# Altium project Science.PrjPCB
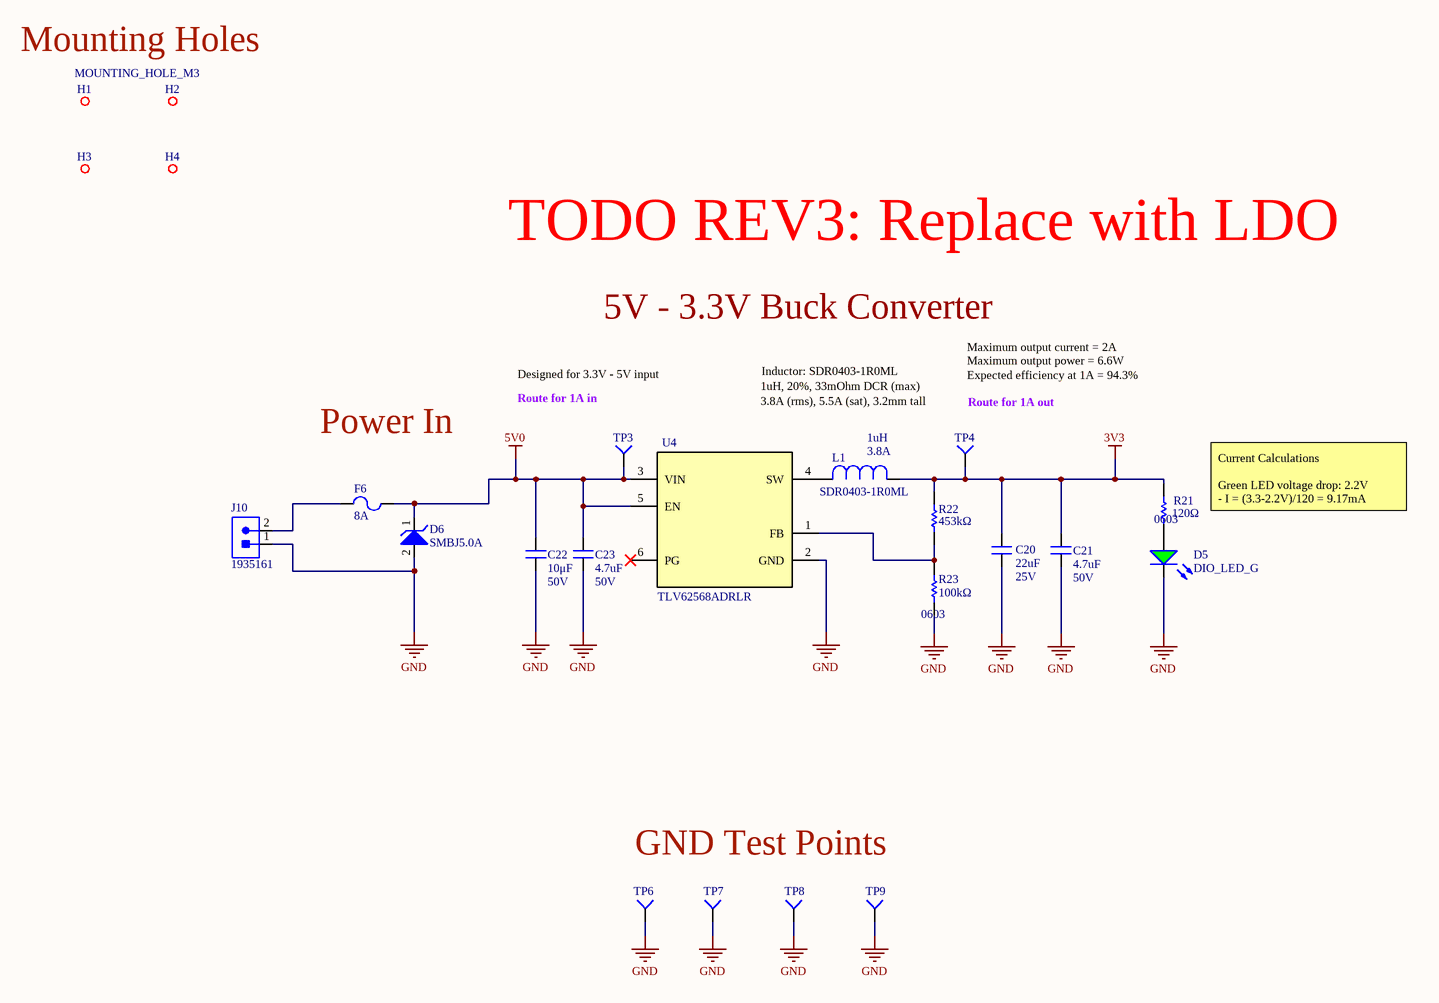
[diagram p0: SH1 - POWER.SchDoc]
Address1: 200 University Avenue; Address2: Waterloo; Address3: Ontario; Address4: Canada N2L 3G6; BoardName: Your Board Name; DrawnBy: Your Name
5 sheets, 120 parts. Net scope: flat (ports and power ports of the same name join across sheets).
Board file: Science.PcbDoc
Sheets:
  SH1 - POWER.SchDoc
  SH2 - CONNECTORS.SchDoc
  SH3 - LEVEL SHIFTER.SchDoc
  SH4 - MICROCONTROLLER.SchDoc
  SH5 - CAN.SchDoc

## Sheet SH1 - POWER.SchDoc: Power
size B; CheckedBy: Lance Bantoto; Engineer: Wolfgang Windholtz; Organization: UW Robotics; Address1: 200 University Avenue; Address2: Waterloo; Address3: Ontario; Address4: Canada N2L 3G6; DocumentNumber: 2; Revision: 2; SheetNumber: 1; SheetTotal: 5

### Parts
C20  Voltage: 25V  Capacitance: 22uF  [CAPC3225X270N]  (hidden comment: CAP_22uF_25V_1210)
C21  Capacitance: 4.7uF  Voltage: 50V  [CAP1206]  (hidden comment: CAP_4.7uF_50V_1206)
C22  value 10μF  Voltage Rating: 50V  [CAP1206]  (hidden comment: CAP_10uF_50V_1206)
C23  Capacitance: 4.7uF  Voltage: 50V  [CAP1206]  (hidden comment: CAP_4.7uF_50V_1206)
D5  DIO_LED_G  [LED_0805_GREEN]
D6  TVS_DIODE_UNIDIR_5V  [SMBJ5.0A]  (value not drawn)
F6  Current Rating: 8A  [FUSE_1206]  (hidden comment: FUSE_8A_1206)
H1  MOUNTING_HOLE_M3  [MOUNTING_HOLE_3mm_SCIENCE_REV2]  (no BOM)
H2  MOUNTING_HOLE_M3  [MOUNTING_HOLE_3mm_SCIENCE_REV2]  (value not drawn)  (no BOM)
H3  MOUNTING_HOLE_M3  [MOUNTING_HOLE_3mm_SCIENCE_REV2]  (value not drawn)  (no BOM)
H4  MOUNTING_HOLE_M3  [MOUNTING_HOLE_3mm_SCIENCE_REV2]  (value not drawn)  (no BOM)
J10  CON_2M_TERM  [1935161]  (value not drawn)
L1  value 1uH  Manufacturer Part Number 1: SDR0403-1R0ML  Current Rating: 3.8A  [IND_BOURNS_SDR04]  (hidden comment: IND_1uH_3.8A)
R21  value 120Ω  Package/Footprint: 0603  [RESC0603]  (hidden comment: RES_120Ω_0603)
R22  value 453kΩ  [RESC0603]  (hidden comment: RES_453kΩ_0603_1%)
R23  value 100kΩ  Package/Footprint: 0603  [RESC0603(1608)_N]  (hidden comment: RES_100kΩ_0603_1%)
TP3  TESTPOINT_SMD_LOOP  [S1751-46R]  (value not drawn)
TP4  TESTPOINT_SMD_LOOP  [S1751-46R]  (value not drawn)
TP6  TESTPOINT_SMD_LOOP  [S1751-46R]  (value not drawn)
TP7  TESTPOINT_1MM_SQUARE  [TESTPOINT_SQUARE_1MM]  (value not drawn)  (no BOM)
TP8  TESTPOINT_1MM_SQUARE  [TESTPOINT_SQUARE_1MM]  (value not drawn)  (no BOM)
TP9  TESTPOINT_1MM_SQUARE  [TESTPOINT_SQUARE_1MM]  (value not drawn)  (no BOM)
U4  TLV62568ADRLR  [SOT50P160X60-6N]

### Nets
3V3: C20.2 C21.2 L1.2 R21.2 R22.2 TP4.1(=value)
5V0: C22.2 C23.2 D6.1 F6.2 TP3.1(=value) U4.3(VIN) U4.5(EN)
GND: C20.1 C21.1 C22.1 C23.1 D5.2(K) D6.2 J10.1 R23.1 TP6.1(=value) TP7.1(=value) TP8.1(=value) TP9.1(=value) U4.2(GND)
NetD5_1: D5.1(A) R21.1
NetF6_1: F6.1 J10.2
NetL1_1: L1.1 U4.4(SW)
NetR22_1: R22.1 R23.2 U4.1(FB)

Not connected (* = marked no-connect by the designer): U4 6(PG)*

### Notes on the sheet
- Mounting Holes
- TODO REV3: Replace with LDO
- Designed for 3.3V - 5V input
- 5V - 3.3V Buck Converter
- Inductor: SDR0403-1R0ML
- Maximum output current = 2A
- Maximum output power = 6.6W
- Expected efficiency at 1A = 94.3%
- Power In
- (near TP3) Route for 1A in
- 1uH, 20%, 33mOhm DCR (max)
- 3.8A (rms), 5.5A (sat), 3.2mm tall
- (near TP4) Route for 1A out
- Current Calculations
  Green LED voltage drop: 2.2V
  - I = (3.3-2.2V)/120 = 9.17mA
- GND Test Points
- Title:
- Project:
- Date:
- Rev:
- Checker:
- Engineer:
- Sheet:
- of

### Library data of the parts
C20 = CAP_22uF_25V_1210: CAP CER 22UF 25V X7R 1210; Manufacturer 1: Murata Electronics; Manufacturer Part Number 1: GRM32ER71E226ME15K; Package/Footprint: 1210; Supplier 1: Digi-Key; Supplier Part Number 1: 490-14682-1-ND; Temperature Coefficient: X7R; Mounting Type: SMD
C21 = CAP_4.7uF_50V_1206: CAP CER 4.7UF 50V X7R 1206; Manufacturer 1: Murata; Manufacturer Part Number 1: GRM31CR71H475KA12L; Package/Footprint: 1206; Supplier 1: Digi-Key; Dielectric: X7R; Supplier Part Number 1: 490-6521-1-ND; Mounting Type: SMD
C22 = CAP_10uF_50V_1206: CAP CER 10UF 50V X5R 1206; Manufacturer Part Number 1: GRT31CR61H106KE01L; Manufacturer 1: Murata; Package/Footprint: 1206; Dimensions: 0.126" L x 0.063" W (3.20mm x 1.6mm); Package: 1206 (3216 Metric); Supplier Part Number 1: 490-12456-1-ND; Supplier 1: Digi-Key; Dielectric: X5R; Manufacturer Part Numer 1: GRT31CR61H106KE01L; Mounting Type: SMD
C23 = CAP_4.7uF_50V_1206: CAP CER 4.7UF 50V X7R 1206; Manufacturer Part Number 1: GRM31CR71H475KA12L; Manufacturer 1: Murata; Package/Footprint: 1206; Supplier Part Number 1: 490-6521-1-ND; Supplier 1: Digi-Key; Dielectric: X7R; Mounting Type: SMD
D5 = DIO_LED_G: LED GREEN DIFFUSED 0805 SMD; Manufacturer Part Number 1: LG R971-KN-1; Manufacturer 1: OSRAM; Forward Voltage Drop: 2.2V; Package/Footprint: 0805; Supplier Part Number 1: 475-1410-1-ND; Supplier 1: Digi-Key; Mounting Type: SMD
D6 = TVS_DIODE_UNIDIR_5V: TVS DIODE 5V 9.2V DO214AA; Manufacturer 1: Bourns; Max Power Dissipation: 600W; Polarity: Unidirectional; Leakage Current: 800uA; Reverse Breakdown Voltage: 6.4V; Max Surge Current: 100A; Breakdown Voltage: 7.25V; Peak Pulse Current: 65.2A; Test Current: 10mA; Number of Channels: 1; Operating Supply Voltage: 3.5V; Power Line Protection: No; Package/Footprint: SMB; Supplier 1: Digi-Key; Number of Pins: 2; Min Operating Temperature: -55°C; Max Operating Temperature: 150°C; Reverse Standoff Voltage: 5V; Min Breakdown Voltage: 6.4V; Clamping Voltage: 9.2V; Peak Pulse Power: 600W; Max Breakdown Voltage: 7.25V; Max Reverse Leakage Current: 800uA; Supplier Part Number 1: SMBJ5.0ABCT-ND; Manufacturer Part Number 1: SMBJ5.0A; Mounting Type: SMD
F6 = FUSE_8A_1206: FUSE SMD 8A 24V; Manufacturer 1: Littelfuse; Manufacturer Part Number 1: 1206SFF800F/24-2; Package/Footprint: 1206; Supplier 1: Digi-Key; Supplier Part Number 1: 1206SFF800F/24-2CT-ND; Mounting Type: SMD; LCSC Part #: C311032
H1-H4 = MOUNTING_HOLE_M3_SCIENCE_REV2: MOUNTING_HOLE_M3 Science Rev2
J10 = CON_2M_TERM: TERM BLK 2POS SIDE ENTRY 5MM; Manufacturer 1: Phoenix Contact; Max Current Rating: 16A; Current: 18A; Voltage: 300V; Package/Footprint: SMD; Supplier 1: Digi-Key; Supplier Part Number 1: 277-1667-ND; Manufacturer Part Number 1: 1935161; Mounting Type: TH
L1 = IND_1uH_3.8A: FIXED IND 1UH 3.8A 33 MOHM SMD; Manufacturer 1: Bourns Inc.; Tolerance: ±20%; Supplier Part Number 1: SDR0403-1R0MLCT-ND; Supplier 1: Digi-Key; Mounting Type: SMD; Package/Footprint: SMD
R21 = RES_120Ω_0603_5%: RES 120 OHM 5% 1/10W 0603; Manufacturer 1: Yageo; Manufacturer Part Number 1: RC0603JR-07120RL; Package: 0603 (1608 Metric); Supplier Part Number 1: 311-120GRCT-ND; Supplier 1: Digi-Key; Mounting Type: SMD
R22 = RES_453kΩ_0603_1%: RES 453K OHM 1% 1/10W 0603; Manufacturer 1: Panasonic Electronic Components; Manufacturer Part Number 1: ERJ-3EKF4533V; Package/Footprint: 0603; Package: 0603 (1608 Metric); Dimensions: 0.063" L x 0.031" W (1.60mm x 0.80mm); Supplier Part Number 1: P453KHCT-ND; Supplier 1: Digi-Key; Case Code (Metric): 1608; Tolerance: 1%; Mounting Type: SMD
R23 = RES_100kΩ_0603_1%: RES 100K OHM 1% 1/10W 0603; Manufacturer 1: Yageo; Manufacturer Part Number 1: RC0603FR-07100KL; Supplier Part Number 1: 311-100KHRCT-ND; Supplier 1: Digi-Key; Tolerance: 1%; Mounting Type: SMD
TP3 TP4 TP6 = TESTPOINT_SMD_LOOP: PC TEST POINT SMD; Manufacturer 1: Harwin; Supplier 1: Digi-Key; Manufacturer Part Number 1: S1751-46R; Supplier Part Number 1: 952-1478-1-ND; Mounting Type: SMD; Package/Footprint: SMD
TP7-TP9 = TESTPOINT_1MM_SQUARE: TESTPOINT 1MM SQUARE; Part Number (MPN): *
U4 = TLV62568ADRLR: IC REG BUCK ADJUSTABLE 2A SOT563; Manufacturer 1: Texas Instruments; Vin (Min): 2.5V; Vin (Max): 5.5V; Vout (Min/Fixed): 0.6V; Iout: 1A; Switching Frequency: 1.5MHz; Package/Footprint: SOT-563; Manufacturer Part Number 1: TLV62568ADRLR; Supplier 1: Digi-Key; Supplier Part Number 1: 296-50407-1-ND; Vout (Max): 5.5V; Iout (Max): 2A; Mounting Type: SMD

## Sheet SH2 - CONNECTORS.SchDoc: Connectors
size B; CheckedBy: Lance Bantoto; Engineer: Wolfgang Windholtz; Organization: UW Robotics; Address1: 200 University Avenue; Address2: Waterloo; Address3: Ontario; Address4: Canada N2L 3G6; Revision: 2; SheetNumber: 2; SheetTotal: 5
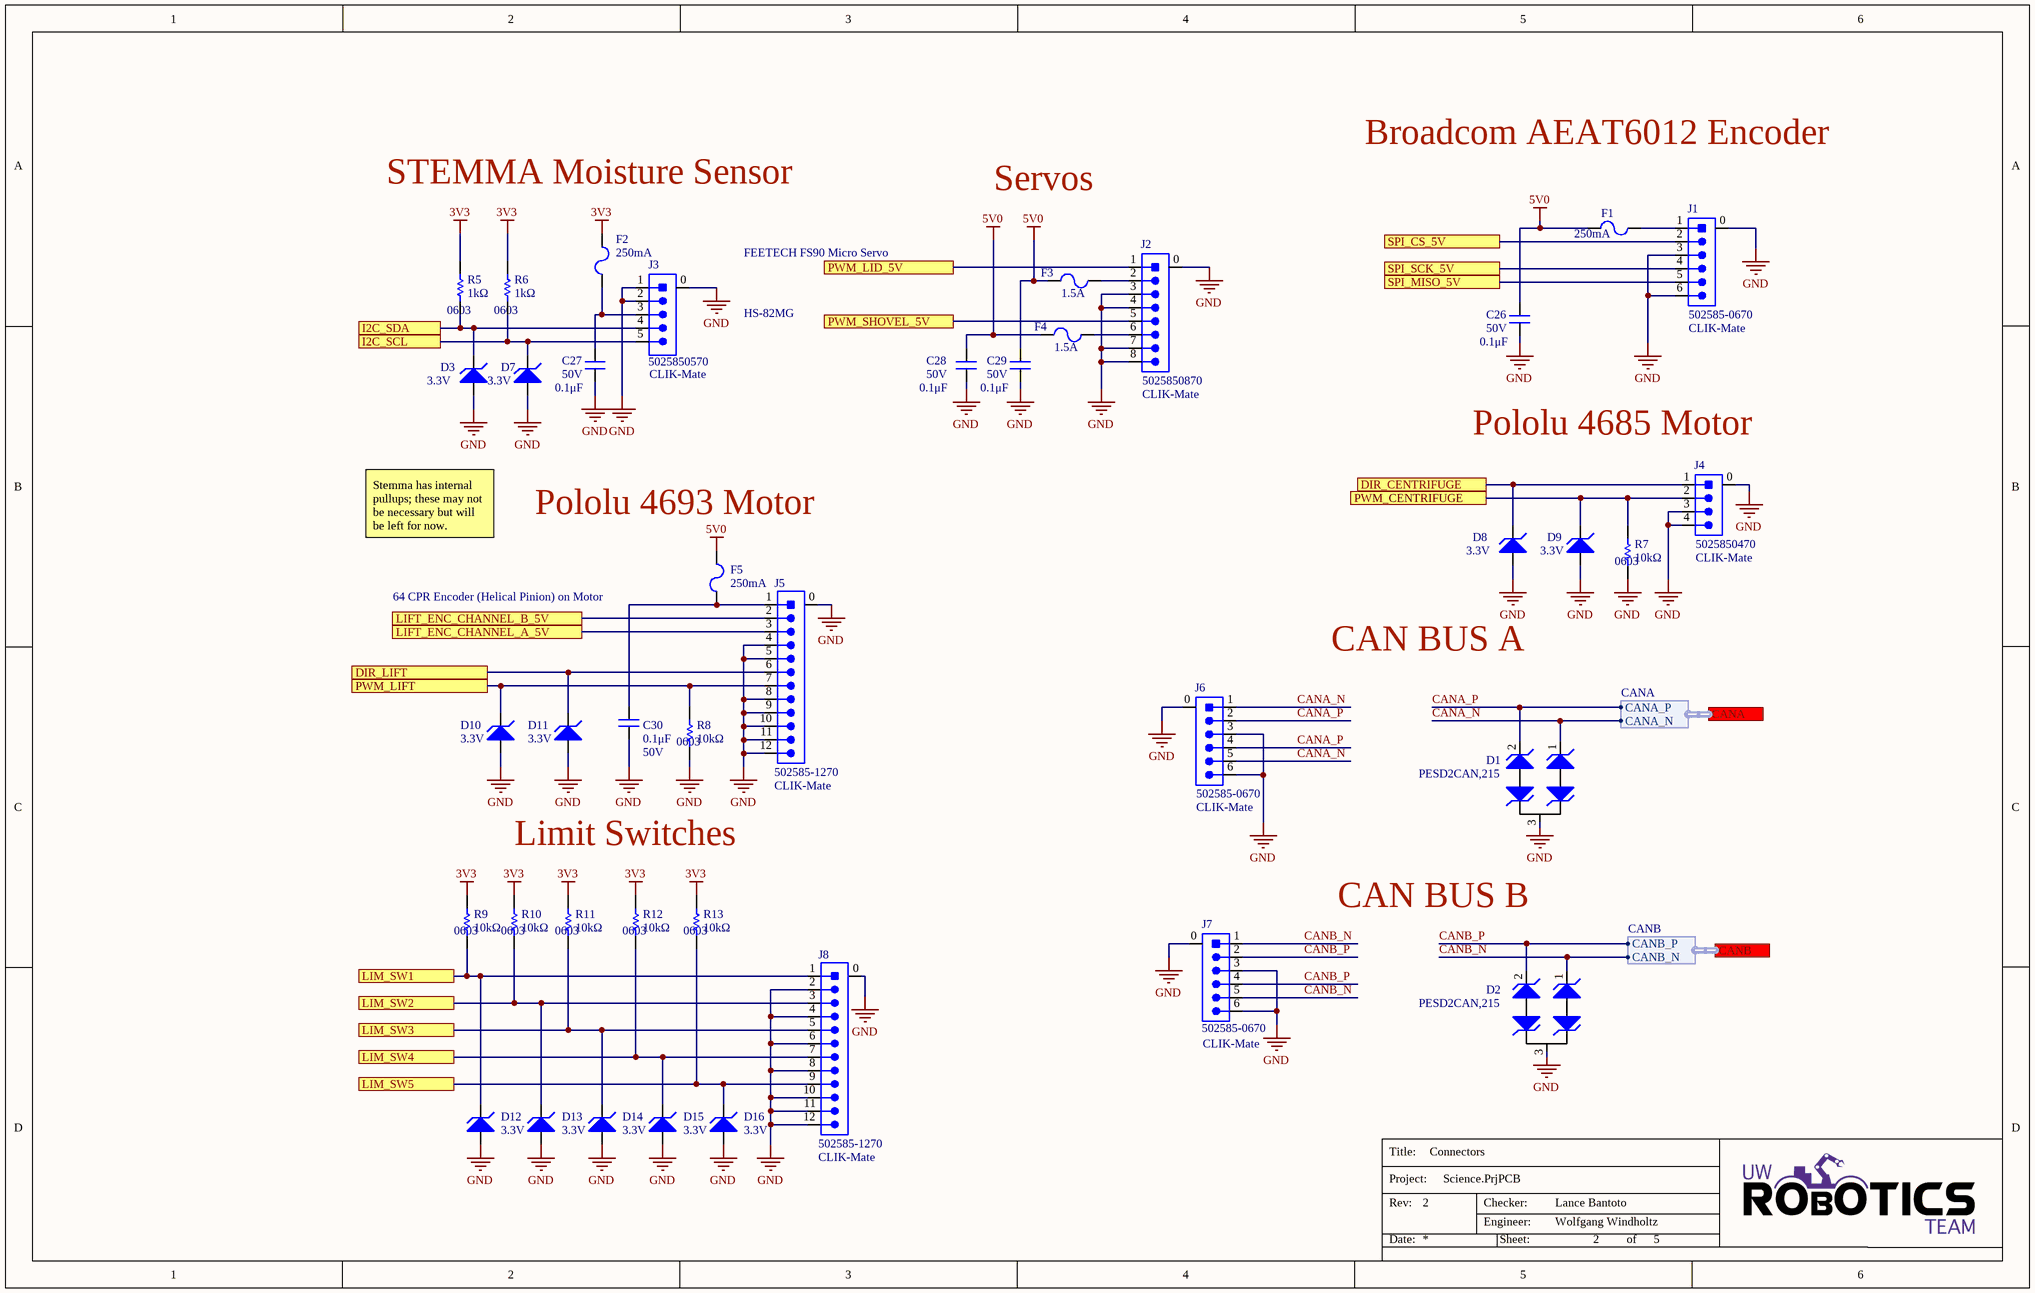
[diagram p1: SH2 - CONNECTORS.SchDoc]

### Parts
C26  value 0.1μF  Voltage Rating: 50V  [CAP0603]  (hidden comment: CAP_0.1uF_50V_0603)
C27  value 0.1μF  Voltage Rating: 50V  [CAP0603]  (hidden comment: CAP_0.1uF_50V_0603)
C28  value 0.1μF  Voltage Rating: 50V  [CAP0603]  (hidden comment: CAP_0.1uF_50V_0603)
C29  value 0.1μF  Voltage Rating: 50V  [CAP0603]  (hidden comment: CAP_0.1uF_50V_0603)
C30  value 0.1μF  Voltage Rating: 50V  [CAP0603]  (hidden comment: CAP_0.1uF_50V_0603)
D1  Manufacturer Part Number 1: PESD2CAN,215  [TVS_DIODE_CAN]  (hidden comment: TVS_DIODE_CAN)
D2  Manufacturer Part Number 1: PESD2CAN,215  [TVS_DIODE_CAN]  (hidden comment: TVS_DIODE_CAN)
D3  Reverse Standoff Voltage: 3.3V  [SOD523_UNI]  (hidden comment: ESD5Z3.3T1G)
D7  Reverse Standoff Voltage: 3.3V  [SOD523_UNI]  (hidden comment: ESD5Z3.3T1G)
D8  Reverse Standoff Voltage: 3.3V  [SOD523_UNI]  (hidden comment: ESD5Z3.3T1G)
D9  Reverse Standoff Voltage: 3.3V  [SOD523_UNI]  (hidden comment: ESD5Z3.3T1G)
D10  Reverse Standoff Voltage: 3.3V  [SOD523_UNI]  (hidden comment: ESD5Z3.3T1G)
D11  Reverse Standoff Voltage: 3.3V  [SOD523_UNI]  (hidden comment: ESD5Z3.3T1G)
D12  Reverse Standoff Voltage: 3.3V  [SOD523_UNI]  (hidden comment: ESD5Z3.3T1G)
D13  Reverse Standoff Voltage: 3.3V  [SOD523_UNI]  (hidden comment: ESD5Z3.3T1G)
D14  Reverse Standoff Voltage: 3.3V  [SOD523_UNI]  (hidden comment: ESD5Z3.3T1G)
D15  Reverse Standoff Voltage: 3.3V  [SOD523_UNI]  (hidden comment: ESD5Z3.3T1G)
D16  Reverse Standoff Voltage: 3.3V  [SOD523_UNI]  (hidden comment: ESD5Z3.3T1G)
F1  Current Rating: 250mA  [FUSE_1206]  (hidden comment: FUSE_250mA_1206)
F2  Current Rating: 250mA  [FUSE_1206]  (hidden comment: FUSE_250mA_1206)
F3  Current Rating: 1.5A  [FUSE_1206]  (hidden comment: FUSE_1.5A_1206)
F4  Current Rating: 1.5A  [FUSE_1206]  (hidden comment: FUSE_1.5A_1206)
F5  Current Rating: 250mA  [FUSE_1206]  (hidden comment: FUSE_250mA_1206)
J1  Manufactor Number: 502585-0670  Family: CLIK-Mate  [MOLEX-5025850670]  (hidden comment: CON_6M_SM_RA_1.5mm)
J2  Manufacturer Part Number: 5025850870  Family: CLIK-Mate  [MOLEX-5025850870]  (hidden comment: CON_8M_SM_RA)
J3  Manufacturer Part Number 1: 5025850570  Family: CLIK-Mate  [MOLEX-5025850570]  (hidden comment: CON_5M_SM_RA)
J4  Manufactor Number: 5025850470  Family: CLIK-Mate  [MOLEX-5025850470]  (hidden comment: CON_4M_SM_RA)
J5  Family: CLIK-Mate  Manufacturer Part Number 1: 502585-1270  [MOLEX-5025851270]  (hidden comment: CON_12M_SM_RA)
J6  Manufactor Number: 502585-0670  Family: CLIK-Mate  [MOLEX-5025850670]  (hidden comment: CON_6M_SM_RA_1.5mm)
J7  Manufactor Number: 502585-0670  Family: CLIK-Mate  [MOLEX-5025850670]  (hidden comment: CON_6M_SM_RA_1.5mm)
J8  Family: CLIK-Mate  Manufacturer Part Number 1: 502585-1270  [MOLEX-5025851270]  (hidden comment: CON_12M_SM_RA)
R5  value 1kΩ  Package/Footprint: 0603  [RESC0603]  (hidden comment: RES_1kΩ_0603_5%)
R6  value 1kΩ  Package/Footprint: 0603  [RESC0603]  (hidden comment: RES_1kΩ_0603_5%)
R7  value 10kΩ  Package/Footprint: 0603  [RESC0603]  (hidden comment: RES_10kΩ_0603_5%)
R8  value 10kΩ  Package/Footprint: 0603  [RESC0603]  (hidden comment: RES_10kΩ_0603_5%)
R9  value 10kΩ  Package/Footprint: 0603  [RESC0603]  (hidden comment: RES_10kΩ_0603_5%)
R10  value 10kΩ  Package/Footprint: 0603  [RESC0603]  (hidden comment: RES_10kΩ_0603_5%)
R11  value 10kΩ  Package/Footprint: 0603  [RESC0603]  (hidden comment: RES_10kΩ_0603_5%)
R12  value 10kΩ  Package/Footprint: 0603  [RESC0603]  (hidden comment: RES_10kΩ_0603_5%)
R13  value 10kΩ  Package/Footprint: 0603  [RESC0603]  (hidden comment: RES_10kΩ_0603_5%)

### Ports
CANA (harness CANA), CANB (harness CANB), DIR_CENTRIFUGE, DIR_LIFT, I2C_SCL, I2C_SDA, LIFT_ENC_CHANNEL_A_5V, LIFT_ENC_CHANNEL_B_5V, LIM_SW1, LIM_SW2, LIM_SW3, LIM_SW4, LIM_SW5, PWM_CENTRIFUGE, PWM_LID_5V, PWM_LIFT, PWM_SHOVEL_5V, SPI_CS_5V, SPI_MISO_5V, SPI_SCK_5V

### Harnesses
CANA: CANA_P, CANA_N
CANB: CANB_P, CANB_N

### Nets
3V3: F2.2 R5.2 R6.2 R9.2 R10.2 R11.2 R12.2 R13.2
5V0: C26.2 C28.2 C29.2 F1.2 F3.1 F4.1 F5.2
GND: C26.1 C27.1 C28.1 C29.1 C30.1 D1.3 D2.3 D3.1(Anode) D7.1(Anode) D8.1(Anode) D9.1(Anode) D10.1(Anode) D11.1(Anode) D12.1(Anode) D13.1(Anode) D14.1(Anode) D15.1(Anode) D16.1(Anode) J1.0 J1.3 J1.6 J2.0 J2.3 J2.4 J2.7 J2.8 J3.0 J3.1 J3.2 J4.0 J4.3 J4.4 J5.0 J5.4 J5.5 J5.8 J5.9 J5.10 J5.11 J5.12 J6.0 J6.3 J6.6 J7.0 J7.3 J7.6 J8.0 J8.2 J8.4 J8.6 J8.8 J8.10 J8.11 J8.12 R7.1 R8.1
CANA_N: D1.1 J6.1 J6.5 ; port CANA.CANA_N
CANA_P: D1.2 J6.2 J6.4 ; port CANA.CANA_P
CANB_N: D2.1 J7.1 J7.5 ; port CANB.CANB_N
CANB_P: D2.2 J7.2 J7.4 ; port CANB.CANB_P
DIR_CENTRIFUGE: D8.2(Cathode) J4.1 ; port DIR_CENTRIFUGE
DIR_LIFT: D11.2(Cathode) J5.6 ; port DIR_LIFT
I2C_SCL: D7.2(Cathode) J3.5 R6.1 ; port I2C_SCL
I2C_SDA: D3.2(Cathode) J3.4 R5.1 ; port I2C_SDA
LIFT_ENC_CHANNEL_A_5V: J5.3 ; port LIFT_ENC_CHANNEL_A_5V
LIFT_ENC_CHANNEL_B_5V: J5.2 ; port LIFT_ENC_CHANNEL_B_5V
LIM_SW1: D12.2(Cathode) J8.1 R9.1 ; port LIM_SW1
LIM_SW2: D13.2(Cathode) J8.3 R10.1 ; port LIM_SW2
LIM_SW3: D14.2(Cathode) J8.5 R11.1 ; port LIM_SW3
LIM_SW4: D15.2(Cathode) J8.7 R12.1 ; port LIM_SW4
LIM_SW5: D16.2(Cathode) J8.9 R13.1 ; port LIM_SW5
PWM_CENTRIFUGE: D9.2(Cathode) J4.2 R7.2 ; port PWM_CENTRIFUGE
PWM_LID_5V: J2.1 ; port PWM_LID_5V
PWM_LIFT: D10.2(Cathode) J5.7 R8.2 ; port PWM_LIFT
PWM_SHOVEL_5V: J2.5 ; port PWM_SHOVEL_5V
SPI_CS_5V: J1.2 ; port SPI_CS_5V
SPI_MISO_5V: J1.5 ; port SPI_MISO_5V
SPI_SCK_5V: J1.4 ; port SPI_SCK_5V
NetC27_2: C27.2 F2.1 J3.3
NetC30_2: C30.2 F5.1 J5.1
NetF1_1: F1.1 J1.1
NetF3_2: F3.2 J2.2
NetF4_2: F4.2 J2.6

### Notes on the sheet
- Broadcom AEAT6012 Encoder
- STEMMA Moisture Sensor
- Servos
- FEETECH FS90 Micro Servo
- HS-82MG
- (near J4) Pololu 4685 Motor
- Stemma has internal pullups; these may not be necessary but will be left for now.
- (near F5) Pololu 4693 Motor
- 64 CPR Encoder (Helical Pinion) on Motor
- CAN BUS A
- Limit Switches
- CAN BUS B
- Title:
- Project:
- Date:
- Rev:
- Checker:
- Engineer:
- Sheet:
- of

### Library data of the parts
C26-C30 = CAP_0.1uF_50V_0603: CAP CER 0.1UF 50V X7R 0603; Manufacturer Part Number 1: CC0603KRX7R9BB104; Manufacturer 1: Yageo; Package/Footprint: 0603; Temperature Coefficient: X7R; Supplier Part Number 1: 311-1344-1-ND; Supplier 1: Digi-Key; Dielectric: X7R; Mounting Type: SMD
D1 D2 = TVS_DIODE_CAN: TVS DIODE 24V 41V SOT323-3; Manufacturer 1: Nexperia USA Inc.; Supplier Part Number 1: 1727-3891-1-ND; Supplier 1: Digi-Key; Package/Footprint: SOT323-3; Mounting Type: SMD
D3 D7-D16 = ESD5Z3.3T1G: TVS DIODE 3.3V 14.1V SOD523; Manufacturer 1: ON Semiconductor; Peak Pulse Power: 158W; Number of Unidirectional Channels: 1; Min Breakdown Voltage: 5V; Power Line Protection: No; Peak Pulse Current: 11.2A; Polarity: Unidirectional; ESD Protection: Yes; Capacitance: 105pF; Max Reverse Leakage Current: 50nA; Max Power Dissipation: 200mW; Package/Footprint: SOD-523; Supplier 1: Digi-Key; Category: ESD and Circuit Protection ICs; Clamping Voltage: 14.1V; Number of Lines: 1; Breakdown Voltage: 5V; Number of Elements: 1; Max Breakdown Voltage: 5V; Reverse Breakdown Voltage: 5V; Max Surge Current: 11.2A; Direction: Unidirectional; Supplier Part Number 1: ESD5Z3.3T1GOSCT-ND; Manufacturer Part Number 1: ESD5Z3.3T1G; Mounting Type: SMD
F1 F2 F5 = FUSE_250mA_1206: FUSE BOARD MNT 250MA 125VAC/VDC; Manufacturer 1: Littelfuse; Manufacturer Part Number 1: 0466.250NR; DC Cold Resistance: 31mR; Power Dissipation: 157.5mW; Approvals: UL,CSA; Working Voltage: 250V; Package/Footprint: 1206; Supplier 1: Digi-Key; Current: 250mA; Length: 3.18mm; Height: 0.023inch; Width: 0.06inch; Depth: 1.52mm; Supplier Part Number 1: F1452CT-ND; Mounting Type: SMD
F3 F4 = FUSE_1.5A_1206: FUSE SMD 1.5A 63V; Manufacturer 1: Littelfuse; Manufacturer Part Number 1: 046601.5NR; Fuse Type: Board Mount (Cartridge Style Excluded); DC Cold Resistance: 31mR; Power Dissipation: 157.5mW; Approvals: UL,CSA; Package/Footprint: 1206; Supplier 1: Digi-Key; Housing Material: Ceramic; Min Operating Temperature: -55°C; Max Operating Temperature: 90°C; Voltage Rating (AC): 63V; Voltage Rating (DC): 63V; Current: 1.5A; Length: 3.18mm; Height: 0.023inch; Width: 0.06inch; Depth: 1.52mm; Supplier Part Number 1: F1462CT-ND; Mounting Type: SMD
J1 J6 J7 = CON_6M_SM_RA_1.5mm: CONN HEADER SMD RIGHT ANGLE 1.5 MM PITCH; Manufacturer: Molex; Supplier 1: Digi-Key; Supplier Part Number 1: WM12832CT-ND; Package/Footprint: SMD; Mounting Type: SMD
J2 = CON_8M_SM_RA: CONN HEADER SMD RIGHT ANGLE 1.5 MM PITCH; Manufacturer: Molex; Current Rating: 2A; Voltage Rating: 100V; Contact Resistance: 20mR; Number of Positions: 8; Connector Type: Receptacle,Center Strip Contact; Gender: Receptacle; Pitch: 1.5mm; Glow Wire Compliant: Non-compliant; Supplier 1: Digi-Key; Category: Headers and Wire Housings; Contact Plating: Tin; Contact Material: Copper,Copper Alloy,Tin; Color: Beige; Housing Color: Beige; Housing Material: Resin; Min Operating Temperature: -40°C; Max Operating Temperature: 85°C; Number of Rows: 1; Contact Gender: Female; Fastening Type: Latch; Orientation: Right Angle; Termination: Solder; Number of Contacts: 8; Number of Circuits: 8; Length: 16.3mm; Depth: 7.3mm; REACH SVHC: Unknown; Supplier Part Number 1: WM14471CT-ND; Mounting Type: SMD; Package/Footprint: SMD
J3 = CON_5M_SM_RA: CONN HEADER SMD RIGHT ANGLE 1.5MM PITCH; Manufacturer 1: Molex; Connector Type: Receptacle,Center Strip Contact; Number of Positions: 5; Current Rating: 2A; Supplier 1: Digi-Key; Termination: Solder; Number of Contacts: 5; Orientation: Right Angle; Number of Circuits: 5; Number of Rows: 1; Supplier Part Number 1: WM14469CT-ND; Mounting Type: SMD; Package/Footprint: SMD
J4 = CON_4M_SM_RA: CONN HEADER SMD RIGHT ANGLE 1.5 MM PITCH; Manufacturer: Molex; Supplier 1: Digi-Key; Supplier Part Number 1: WM9449CT-ND; Package/Footprint: SMD; Mounting Type: SMD
J5 J8 = CON_12M_SM_RA: CONN HEADER SMD RIGHT ANGLE 1.5MM PITCH; Manufacturer 1: Molex; Number of Positions: 12; Connector Type: Receptacle,Center Strip Contact; Current Rating: 2A; Gender: Receptacle; Voltage Rating: 100V; Supplier 1: Digi-Key; Contact Plating: Tin; Contact Material: Copper Alloy,Copper,Tin; Color: Beige; Housing Material: Thermoplastic; Termination: Solder; Contact Gender: Female; Number of Contacts: 12; Number of Rows: 1; Orientation: Right Angle; Fastening Type: Latch; Number of Circuits: 12; Pitch: 1.5mm; Supplier Part Number 1: WM14473CT-ND; Mounting Type: SMD; Package/Footprint: SMD
R5 R6 = RES_1kΩ_0603_5%: RES 1K OHM 5% 1/10W 0603; Manufacturer 1: Yageo; Manufacturer Part Number 1: RC0603JR-071KL; Supplier Part Number 1: 311-1.0KGRCT-ND; Supplier 1: Digi-Key; Tolerance: 5%; Mounting Type: SMD
R7-R13 = RES_10kΩ_0603_5%: RES 10K OHM 5% 1/10W 0603; Manufacturer 1: Yageo; Manufacturer Part Number 1: RC0603JR-0710KL; Package: 0603 (1608 Metric); Supplier Part Number 1: 311-10KGRCT-ND; Supplier 1: Digi-Key; Case Code (Metric): 1608; Tolerance: 5%; Mounting Type: SMD

## Sheet SH3 - LEVEL SHIFTER.SchDoc: Level Shifter
size B; CheckedBy: Lance Bantoto; Engineer: Wolfgang Windholtz; Organization: UW Robotics; Address1: 200 University Avenue; Address2: Waterloo; Address3: Ontario; Address4: Canada N2L 3G6; Revision: 2; SheetNumber: 3; SheetTotal: 5
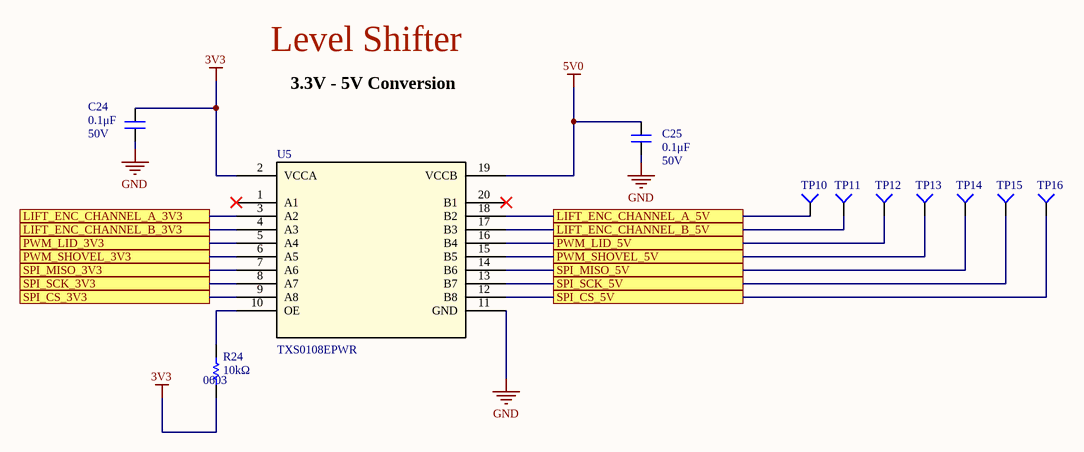
[diagram p2: SH3 - LEVEL SHIFTER.SchDoc]

### Parts
C24  value 0.1μF  Voltage Rating: 50V  [CAP0603]  (hidden comment: CAP_0.1uF_50V_0603)
C25  value 0.1μF  Voltage Rating: 50V  [CAP0603]  (hidden comment: CAP_0.1uF_50V_0603)
R24  value 10kΩ  Package/Footprint: 0603  [RESC0603]  (hidden comment: RES_10kΩ_0603_5%)
TP10  TESTPOINT_1MM_CIRCLE  [TESTPOINT_CIRCLE_1MM]  (value not drawn)  (no BOM)
TP11  TESTPOINT_1MM_CIRCLE  [TESTPOINT_CIRCLE_1MM]  (value not drawn)  (no BOM)
TP12  TESTPOINT_1MM_CIRCLE  [TESTPOINT_CIRCLE_1MM]  (value not drawn)  (no BOM)
TP13  TESTPOINT_1MM_CIRCLE  [TESTPOINT_CIRCLE_1MM]  (value not drawn)  (no BOM)
TP14  TESTPOINT_1MM_CIRCLE  [TESTPOINT_CIRCLE_1MM]  (value not drawn)  (no BOM)
TP15  TESTPOINT_1MM_CIRCLE  [TESTPOINT_CIRCLE_1MM]  (value not drawn)  (no BOM)
TP16  TESTPOINT_1MM_CIRCLE  [TESTPOINT_CIRCLE_1MM]  (value not drawn)  (no BOM)
U5  Manufacturer Part Number 1: TXS0108EPWR  [LEVEL_SHIFTER_8_CHANNEL]  (hidden comment: IC_LVL_SHIFTER_8_CH)

### Ports
LIFT_ENC_CHANNEL_A_3V3, LIFT_ENC_CHANNEL_A_5V, LIFT_ENC_CHANNEL_B_3V3, LIFT_ENC_CHANNEL_B_5V, PWM_LID_3V3, PWM_LID_5V, PWM_SHOVEL_3V3, PWM_SHOVEL_5V, SPI_CS_3V3, SPI_CS_5V, SPI_MISO_3V3, SPI_MISO_5V, SPI_SCK_3V3, SPI_SCK_5V

### Nets
3V3: C24.2 R24.1 U5.2(VCCA)
5V0: C25.2 U5.19(VCCB)
GND: C24.1 C25.1 U5.11(GND)
LIFT_ENC_CHANNEL_A_3V3: U5.3(A2) ; port LIFT_ENC_CHANNEL_A_3V3
LIFT_ENC_CHANNEL_A_5V: TP10.1(=value) U5.18(B2) ; port LIFT_ENC_CHANNEL_A_5V
LIFT_ENC_CHANNEL_B_3V3: U5.4(A3) ; port LIFT_ENC_CHANNEL_B_3V3
LIFT_ENC_CHANNEL_B_5V: TP11.1(=value) U5.17(B3) ; port LIFT_ENC_CHANNEL_B_5V
PWM_LID_3V3: U5.5(A4) ; port PWM_LID_3V3
PWM_LID_5V: TP12.1(=value) U5.16(B4) ; port PWM_LID_5V
PWM_SHOVEL_3V3: U5.6(A5) ; port PWM_SHOVEL_3V3
PWM_SHOVEL_5V: TP13.1(=value) U5.15(B5) ; port PWM_SHOVEL_5V
SPI_CS_3V3: U5.9(A8) ; port SPI_CS_3V3
SPI_CS_5V: TP16.1(=value) U5.12(B8) ; port SPI_CS_5V
SPI_MISO_3V3: U5.7(A6) ; port SPI_MISO_3V3
SPI_MISO_5V: TP14.1(=value) U5.14(B6) ; port SPI_MISO_5V
SPI_SCK_3V3: U5.8(A7) ; port SPI_SCK_3V3
SPI_SCK_5V: TP15.1(=value) U5.13(B7) ; port SPI_SCK_5V
NetR24_2: R24.2 U5.10(OE)

Not connected (* = marked no-connect by the designer): U5 1(A1)* 20(B1)*

### Notes on the sheet
- Level Shifter
- 3.3V - 5V Conversion
- Title:
- Project:
- Date:
- Rev:
- Checker:
- Engineer:
- Sheet:
- of

### Library data of the parts
C24 C25 = CAP_0.1uF_50V_0603: CAP CER 0.1UF 50V X7R 0603; Manufacturer 1: Yageo; Manufacturer Part Number 1: CC0603KRX7R9BB104; Package/Footprint: 0603; Supplier 1: Digi-Key; Dielectric: X7R; Supplier Part Number 1: 311-1344-1-ND; Temperature Coefficient: X7R; Mounting Type: SMD
R24 = RES_10kΩ_0603_5%: as R7 on sheet SH2 - CONNECTORS; Supplier 1: Digi-Key; Case Code (Metric): 1608; Tolerance: 5%; Supplier Part Number 1: 311-10KGRCT-ND; Package: 0603 (1608 Metric); Mounting Type: SMD
TP10-TP16 = TESTPOINT_1MM_CIRCLE: TESTPOINT 1MM CIRCLE; Part Number (MPN): *
U5 = IC_LVL_SHIFTER_8_CH: IC BIDIRECTIONAL LEVEL SHIFTER 8 CHANNEL 20TSSOP; Manufacturer 1: Texas Instruments; Package/Footprint: 20-TSSOP; ComponentLink1Description: New link; ComponentLink1URL: *; Supplier 1: Digi-Key; Supplier Part Number 1: 296-23011-1-ND; Mounting Type: SMD

## Sheet SH4 - MICROCONTROLLER.SchDoc: Microcontroller
size B; CheckedBy: Lance Bantoto; Engineer: Wolfgang Windholtz; Organization: UW Robotics; Address1: 200 University Avenue; Address2: Waterloo; Address3: Ontario; Address4: Canada N2L 3G6; Revision: 2; SheetNumber: 4; SheetTotal: 5
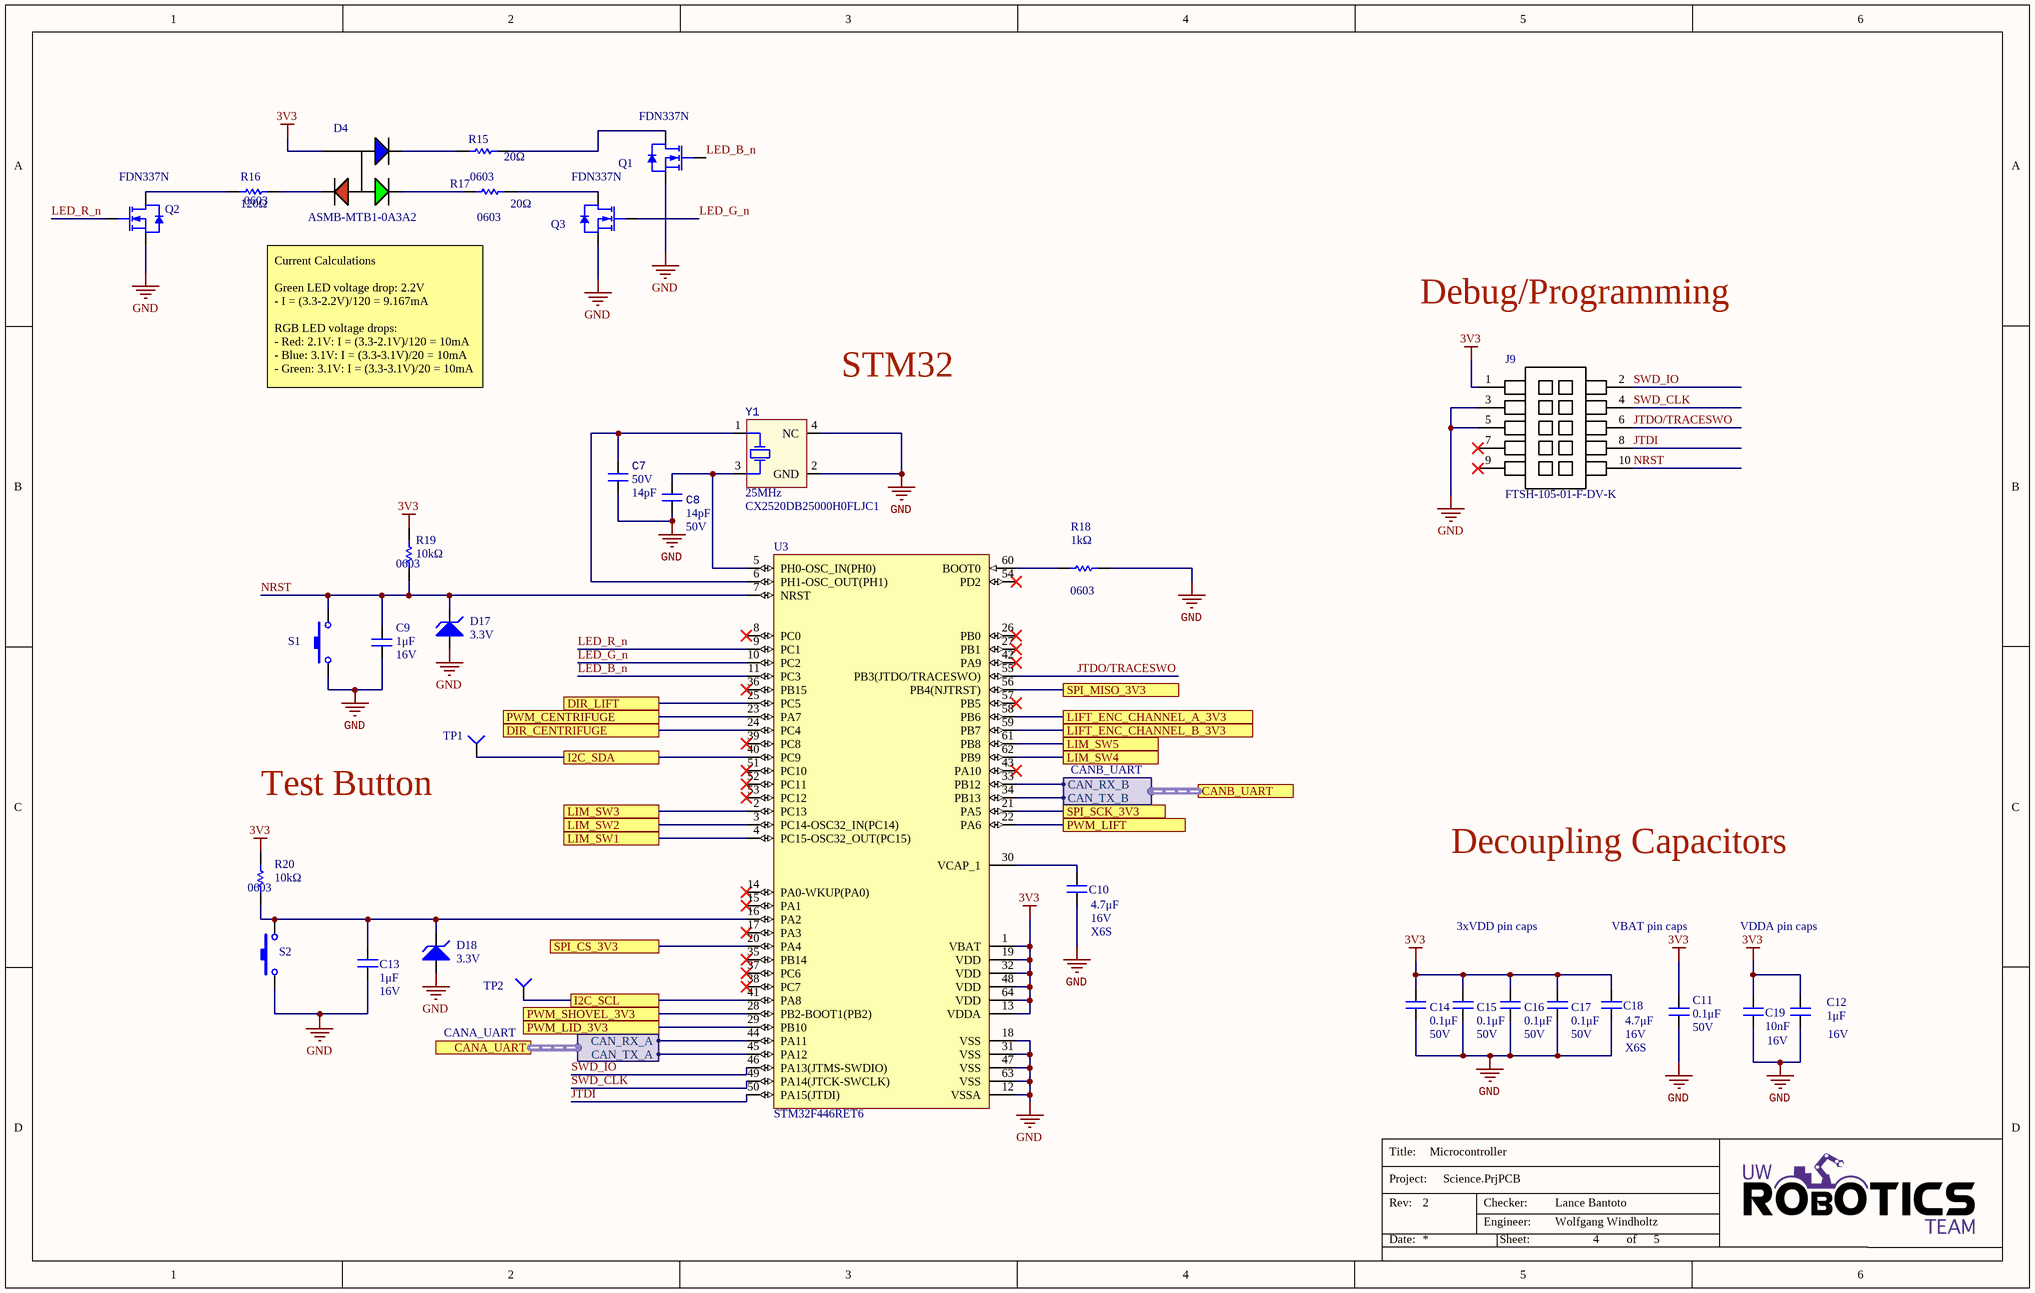
[diagram p3: SH4 - MICROCONTROLLER.SchDoc]

### Parts
C7  value 14pF  Voltage Rating: 50V  [CAP0603]  (hidden comment: CAP_14pF_50V_0603)
C8  value 14pF  Voltage Rating: 50V  [CAP0603]  (hidden comment: CAP_14pF_50V_0603)
C9  value 1μF  Voltage Rating: 16V  [CAP0603]  (hidden comment: CAP_1uF_16V_0603)
C10  value 4.7μF  Dielectric: X6S  Voltage Rating: 16V  [CAP0603]  (hidden comment: CAP_4.7uF_16V_0603)
C11  value 0.1μF  Voltage Rating: 50V  [CAP0603]  (hidden comment: CAP_0.1uF_50V_0603)
C12  value 1μF  Voltage Rating: 16V  [CAP0603]  (hidden comment: CAP_1uF_16V_0603)
C13  value 1μF  Voltage Rating: 16V  [CAP0603]  (hidden comment: CAP_1uF_16V_0603)
C14  value 0.1μF  Voltage Rating: 50V  [CAP0603]  (hidden comment: CAP_0.1uF_50V_0603)
C15  value 0.1μF  Voltage Rating: 50V  [CAP0603]  (hidden comment: CAP_0.1uF_50V_0603)
C16  value 0.1μF  Voltage Rating: 50V  [CAP0603]  (hidden comment: CAP_0.1uF_50V_0603)
C17  value 0.1μF  Voltage Rating: 50V  [CAP0603]  (hidden comment: CAP_0.1uF_50V_0603)
C18  value 4.7μF  Dielectric: X6S  Voltage Rating: 16V  [CAP0603]  (hidden comment: CAP_4.7uF_16V_0603)
C19  value 10nF  Voltage Rating: 16V  [CAP0603]  (hidden comment: CAP_10nF_0603)
D4  Manufacturer Part Number 1: ASMB-MTB1-0A3A2  [LED_RGB]  (hidden comment: LED_RGB)
D17  Reverse Standoff Voltage: 3.3V  [SOD523_UNI]  (hidden comment: ESD5Z3.3T1G)
D18  Reverse Standoff Voltage: 3.3V  [SOD523_UNI]  (hidden comment: ESD5Z3.3T1G)
J9  Manufacturer Part Number 1: FTSH-105-01-F-DV-K  [FTSH-105-01-F-DV-K-P-TR]  (hidden comment: CON_PROGRAMMING)
Q1  Manufacturer Part Number 1: FDN337N  [NMOS_SSOT-3]  (hidden comment: NMOS_30V_2.2A)
Q2  Manufacturer Part Number 1: FDN337N  [NMOS_SSOT-3]  (hidden comment: NMOS_30V_2.2A)
Q3  Manufacturer Part Number 1: FDN337N  [NMOS_SSOT-3]  (hidden comment: NMOS_30V_2.2A)
R15  value 20Ω  Package/Footprint: 0603  [RESC0603]  (hidden comment: RES_20Ω_0603_5%)
R16  value 120Ω  Package/Footprint: 0603  [RESC0603]  (hidden comment: RES_120Ω_0603)
R17  value 20Ω  Package/Footprint: 0603  [RESC0603]  (hidden comment: RES_20Ω_0603_5%)
R18  value 1kΩ  Package/Footprint: 0603  [RESC0603]  (hidden comment: RES_1kΩ_0603_5%)
R19  value 10kΩ  Package/Footprint: 0603  [RESC0603]  (hidden comment: RES_10kΩ_0603_5%)
R20  value 10kΩ  Package/Footprint: 0603  [RESC0603]  (hidden comment: RES_10kΩ_0603_5%)
S1  SW_TACTILE  [B3U-1000P]  (value not drawn)
S2  SW_TACTILE  [B3U-1000P]  (value not drawn)
TP1  TESTPOINT_1MM_CIRCLE  [TESTPOINT_CIRCLE_1MM]  (value not drawn)  (no BOM)
TP2  TESTPOINT_1MM_CIRCLE  [TESTPOINT_CIRCLE_1MM]  (value not drawn)  (no BOM)
U3  STM32F446RET6  [STM-LQFP64_L]
Y1  Frequency: 25MHz  Manufacturer Part Number 1: CX2520DB25000H0FLJC1  [SOIC254P1016X440-4N]  (hidden comment: CRYSTAL_25MHZ)

### Ports
CANA_UART (harness CANA_UART), CANB_UART (harness CANB_UART), DIR_CENTRIFUGE, DIR_LIFT, I2C_SCL, I2C_SDA, LIFT_ENC_CHANNEL_A_3V3, LIFT_ENC_CHANNEL_B_3V3, LIM_SW1, LIM_SW2, LIM_SW3, LIM_SW4, LIM_SW5, PWM_CENTRIFUGE, PWM_LID_3V3, PWM_LIFT, PWM_SHOVEL_3V3, SPI_CS_3V3, SPI_MISO_3V3, SPI_SCK_3V3

### Harnesses
CANA_UART: CAN_RX_A, CAN_TX_A
CANB_UART: CAN_RX_B, CAN_TX_B

### Nets
3V3: C11.2 C12.2 C14.2 C15.2 C16.2 C17.2 C18.2 C19.2 D4.4(COMMON_ANODE) J9.1 R19.2 R20.2 U3.1(VBAT) U3.13(VDDA) U3.19(VDD) U3.32(VDD) U3.48(VDD) U3.64(VDD)
GND: C7.1 C8.1 C9.1 C10.1 C11.1 C12.1 C13.1 C14.1 C15.1 C16.1 C17.1 C18.1 C19.1 D17.1(Anode) D18.1(Anode) J9.3 J9.5 Q1.2(SOURCE) Q2.2(SOURCE) Q3.2(SOURCE) R18.2 S1.2 S2.1 U3.12(VSSA) U3.18(VSS) U3.31(VSS) U3.47(VSS) U3.63(VSS) Y1.2(GND) Y1.4(NC)
DIR_CENTRIFUGE: U3.24(PC4) ; port DIR_CENTRIFUGE
DIR_LIFT: U3.25(PC5) ; port DIR_LIFT
I2C_SCL: TP2.1(=value) U3.41(PA8) ; port I2C_SCL
I2C_SDA: TP1.1(=value) U3.40(PC9) ; port I2C_SDA
JTDI: J9.8 U3.50(PA15(JTDI))
JTDO/TRACESWO: J9.6 U3.55(PB3(JTDO/TRACESWO))
LED_B_n: Q1.1(GATE) U3.11(PC3)
LED_G_n: Q3.1(GATE) U3.10(PC2)
LED_R_n: Q2.1(GATE) U3.9(PC1)
LIFT_ENC_CHANNEL_A_3V3: U3.58(PB6) ; port LIFT_ENC_CHANNEL_A_3V3
LIFT_ENC_CHANNEL_B_3V3: U3.59(PB7) ; port LIFT_ENC_CHANNEL_B_3V3
LIM_SW1: U3.4(PC15-OSC32_OUT(PC15)) ; port LIM_SW1
LIM_SW2: U3.3(PC14-OSC32_IN(PC14)) ; port LIM_SW2
LIM_SW3: U3.2(PC13) ; port LIM_SW3
LIM_SW4: U3.62(PB9) ; port LIM_SW4
LIM_SW5: U3.61(PB8) ; port LIM_SW5
NRST: C9.2 D17.2(Cathode) J9.10 R19.1 S1.1 U3.7(NRST)
PWM_CENTRIFUGE: U3.23(PA7) ; port PWM_CENTRIFUGE
PWM_LID_3V3: U3.29(PB10) ; port PWM_LID_3V3
PWM_LIFT: U3.22(PA6) ; port PWM_LIFT
PWM_SHOVEL_3V3: U3.28(PB2-BOOT1(PB2)) ; port PWM_SHOVEL_3V3
SPI_CS_3V3: U3.20(PA4) ; port SPI_CS_3V3
SPI_MISO_3V3: U3.56(PB4(NJTRST)) ; port SPI_MISO_3V3
SPI_SCK_3V3: U3.21(PA5) ; port SPI_SCK_3V3
SWD_CLK: J9.4 U3.49(PA14(JTCK-SWCLK))
SWD_IO: J9.2 U3.46(PA13(JTMS-SWDIO))
NetC7_2: C7.2 U3.6(PH1-OSC_OUT(PH1)) Y1.1(HOT)
NetC8_2: C8.2 U3.5(PH0-OSC_IN(PH0)) Y1.3(HOT)
NetC10_2: C10.2 U3.30(VCAP_1)
NetC13_2: C13.2 D18.2(Cathode) R20.1 S2.2 U3.16(PA2)
NetD4_1: D4.1(CATHODE_(RED)) R16.2
NetD4_2: D4.2(CATHODE_(GREEN)) R17.1
NetD4_3: D4.3(CATHODE_(BLUE)) R15.1
NetQ1_3: Q1.3(DRAIN) R15.2
NetQ2_3: Q2.3(DRAIN) R16.1
NetQ3_3: Q3.3(DRAIN) R17.2
NetR18_1: R18.1 U3.60(BOOT0)
NetU1_1: U3.45(PA12) ; port CANA_UART.CAN_TX_A
NetU1_4: U3.44(PA11) ; port CANA_UART.CAN_RX_A
NetU2_1: U3.34(PB13) ; port CANB_UART.CAN_TX_B
NetU2_4: U3.33(PB12) ; port CANB_UART.CAN_RX_B

Not connected (* = marked no-connect by the designer): J9 7* 9*; U3 8(PC0)* 14(PA0-WKUP(PA0))* 15(PA1)* 17(PA3)* 26(PB0)* 27(PB1)* 35(PB14)* 36(PB15)* 37(PC6)* 38(PC7)* 39(PC8)* 42(PA9)* 43(PA10)* 51(PC10)* 52(PC11)* 53(PC12)* 54(PD2)* 57(PB5)*

### Notes on the sheet
- Debug/Programming
- Current Calculations
  Green LED voltage drop: 2.2V
  - I = (3.3-2.2V)/120 = 9.167mA
  RGB LED voltage drops:
  - Red: 2.1V: I = (3.3-2.1V)/120 = 10mA
  - Blue: 3.1V: I = (3.3-3.1V)/20 = 10mA
  - Green: 3.1V: I = (3.3-3.1V)/20 = 10mA
- STM32
- (near TP1) Test Button
- Decoupling Capacitors
- 3xVDD pin caps
- VBAT pin caps
- VDDA pin caps
- Title:
- Project:
- Date:
- Rev:
- Checker:
- Engineer:
- Sheet:
- of

### Library data of the parts
C7 C8 = CAP_14pF_50V_0603: CAP CER 14PF 50V C0G/NP0 0603; Manufacturer 1: Samsung; Manufacturer Part Number 1: CL10C140JB8NNNC; Dielectric: C0G; Package/Footprint: 0603; Supplier 1: Digi-Key; Supplier Part Number 1: 1276-2187-1-ND; Mounting Type: SMD
C9 C13 = CAP_1uF_16V_0603: CAP CER 1UF 16V Y5V 0603; Manufacturer 1: Yageo; Manufacturer Part Number 1: CC0603ZRY5V7BB105; Package/Footprint: 0603; Dielectric: Y5V; Supplier 1: Digi-Key; Supplier Part Number 1: 311-1372-1-ND; Package: 0603 (1608 Metric); Manufacturer Part Number: CC0603ZRY5V7BB105; Dimensions: 0.063" L x 0.031" W (1.60mm x 0.80mm); Temperature Coefficient: Y5V; Mounting Type: SMD
C10 C18 = CAP_4.7uF_16V_0603: CAP CER 4.7UF 16V X6S 0603; Manufacturer Part Number 1: GRM188C81C475KE11D; Manufacturer 1: Murata Electronics; Package/Footprint: 0603; Package: 0603 (1608 Metric); Supplier Part Number 1: 490-13362-1-ND; Supplier 1: Digi-Key; Mounting Type: SMD
C11 C14-C17 = CAP_0.1uF_50V_0603: as C26 on sheet SH2 - CONNECTORS; Temperature Coefficient: X7R; Supplier Part Number 1: 311-1344-1-ND; Supplier 1: Digi-Key; Dielectric: X7R; Mounting Type: SMD
C12 = CAP_1uF_16V_0603: CAP CER 1UF 16V Y5V 0603; Manufacturer Part Number: CC0603ZRY5V7BB105; Manufacturer 1: Yageo; Package/Footprint: 0603; Dimensions: 0.063" L x 0.031" W (1.60mm x 0.80mm); Package: 0603 (1608 Metric); Temperature Coefficient: Y5V; Supplier Part Number 1: 311-1372-1-ND; Supplier 1: Digi-Key; Manufacturer Part Number 1: CC0603ZRY5V7BB105; Dielectric: Y5V; Mounting Type: SMD
C19 = CAP_10nF_0603: CAP CER 10000PF 16V X7R 0603; Manufacturer Part Number 1: CC0603KRX7R7BB103; Manufacturer 1: Yageo; Package/Footprint: 0603; Supplier Part Number 1: 311-3369-1-ND; Supplier 1: Digi-Key; Dielectric: X7R; Mounting Type: SMD
D4 = LED_RGB: LED RGB DIFFUSED 4PLCC SMD; Manufacturer 1: Broadcom; Color: Blue,Green,Red; Lens Color: White; Viewing Angle: 115°; Lens Style: Round; Luminous Intensity: 350mcd; Dominant Wavelength: 470nm; Forward Voltage: 3.1V; Test Current: 20mA; Package/Footprint: 4-PLCC; Supplier 1: Digi-Key; Case/Package: PLCC; Number of Pins: 4; Lens Transparency: Diffused; Length: 3.2mm; Height: 1.9mm; Width: 2.8mm; Supplier Part Number 1: 516-3280-1-ND; Mounting Type: SMD
D17 D18 = ESD5Z3.3T1G: as D3 on sheet SH2 - CONNECTORS; Supplier 1: Digi-Key; Category: ESD and Circuit Protection ICs; Clamping Voltage: 14.1V; Number of Lines: 1; Breakdown Voltage: 5V; Number of Elements: 1; Max Breakdown Voltage: 5V; Reverse Breakdown Voltage: 5V; Max Surge Current: 11.2A; Direction: Unidirectional; Supplier Part Number 1: ESD5Z3.3T1GOSCT-ND; Manufacturer Part Number 1: ESD5Z3.3T1G; Mounting Type: SMD
J9 = CON_PROGRAMMING: CONN HEADER SMD 10POS 1.27MM; Manufacturer 1: Samtec; Max Current Rating: 1.75A; Supplier 1: Digi-Key; Pitch: 1.27mm; Supplier Part Number 1: SAM8796-ND; Mounting Type: SMD; Package/Footprint: SMD
Q1-Q3 = NMOS_30V_2.2A: MOSFET N-CH 30V 2.2A SUPERSOT3; Manufacturer 1: ON Semiconductor / Fairchild; Element Configuration: Single; Drain to Source Resistance: 65mR; Turn-Off Delay Time: 17ns; Gate to Source Voltage (Vgs): 8V; Rise Time: 10ns; Max Power Dissipation: 500mW; Fall Time: 4ns; Input Capacitance: 300pF; Number of Elements: 1; Threshold Voltage: 700mV; Package/Footprint: SuperSOT-3; Supplier 1: Digi-Key; Category: MOSFETs; Max Operating Temperature: 150°C; Continuous Drain Current (ID): 2.2A; Drain to Source Breakdown Voltage: 30V; Power Dissipation: 500mW; Turn-On Delay Time: 4ns; Rds On Max: 65mR; Drain to Source Voltage (Vdss): 30V; On-State Resistance: 65mR; Voltage Rating (DC): 30V; Current Rating: 2.2A; Dual Supply Voltage: 30V; Nominal Vgs: 700mV; Supplier Part Number 1: FDN337NCT-ND; Mounting Type: SMD
R15 R17 = RES_20Ω_0603_5%: RES 20 OHM 5% 1/10W 0603; Manufacturer 1: Yageo; Manufacturer Part Number 1: RC0603JR-0720RL; Package: 0603 (1608 Metric); Dimensions: 0.063" L x 0.031" W (1.60mm x 0.80mm); Supplier Part Number 1: 311-20GRCT-ND; Supplier 1: Digi-Key; Tolerance: 5%; Mounting Type: SMD
R16 = RES_120Ω_0603_5%: as R21 on sheet SH1 - POWER; Package: 0603 (1608 Metric); Supplier Part Number 1: 311-120GRCT-ND; Supplier 1: Digi-Key; Mounting Type: SMD
R18 = RES_1kΩ_0603_5%: as R5 on sheet SH2 - CONNECTORS; Supplier Part Number 1: 311-1.0KGRCT-ND; Supplier 1: Digi-Key; Tolerance: 5%; Mounting Type: SMD
R19 R20 = RES_10kΩ_0603_5%: as R7 on sheet SH2 - CONNECTORS; Supplier 1: Digi-Key; Case Code (Metric): 1608; Tolerance: 5%; Supplier Part Number 1: 311-10KGRCT-ND; Package: 0603 (1608 Metric); Mounting Type: SMD
S1 S2 = SW_TACTILE: SWITCH TACTILE SPST-NO 0.05A 12V; Manufacturer 1: Omron Electronics Inc-EMC Div; Package/Footprint: SMD; Manufacturer Part Number 1: B3U-1000P; Supplier 1: Digi-Key; Supplier Part Number 1: SW1020CT-ND; Mounting Type: SMD
TP1 TP2 = TESTPOINT_1MM_CIRCLE: TESTPOINT 1MM CIRCLE; Part Number (MPN): *
U3 = MCU_STM32F446RET6: ARM Cortex-M4 32-bit MCU+FPU, 512 KB Flash, 128 KB Internal RAM, 50 I/Os, 64-Pin LQFP, -40 to 85 degC, Tray; I/Os (High Current): 50; Supply Voltage(Vcc) min (V): 1.7; Operating Frequency(F) (Processor speed) (MHz): 180; D/A Converter: 2; Internal RAM Size (kB): 128; FLASH Size (Prog) (kB): 512; Core: ARM Cortex-M4; ComponentLink1Description: Manufacturer URL; Package Reference: 64-Pin Low-profile Quad Flat Package, Body 10 x 10 mm, Pitch 0.5 mm; ComponentLink2URL: http://www.st.com/st-web-ui/static/active/en/resource/technical/document/datasheet/DM00141306.pdf; Packing: Tray; DatasheetVersion: Rev. 6; ComponentLink1URL: http://www.st.com/; ComponentLink2Description: Datasheet; Package Description: LQFP64; Mounting Technology: Surface Mount; Supplier 1: Digi-Key; Supplier Part Number 1: 497-15376-ND
Y1 = CRYSTAL_25MHZ: CRYSTAL 25.0000MHZ 12PF SMD; Manufacturer 1: Kyocera AVX; Load Capacitance: 12pF; Supplier 1: Digi-Key; Supplier Part Number 1: 1253-1724-1-ND; Mounting Type: SMD; Package/Footprint: SMD

## Sheet SH5 - CAN.SchDoc: CAN
size B; CheckedBy: Lance Bantoto; Engineer: Wolfgang Windholtz; Organization: UW Robotics; Address1: 200 University Avenue; Address2: Waterloo; Address3: Ontario; Address4: Canada N2L 3G6; Revision: 2; SheetNumber: 5; SheetTotal: 5
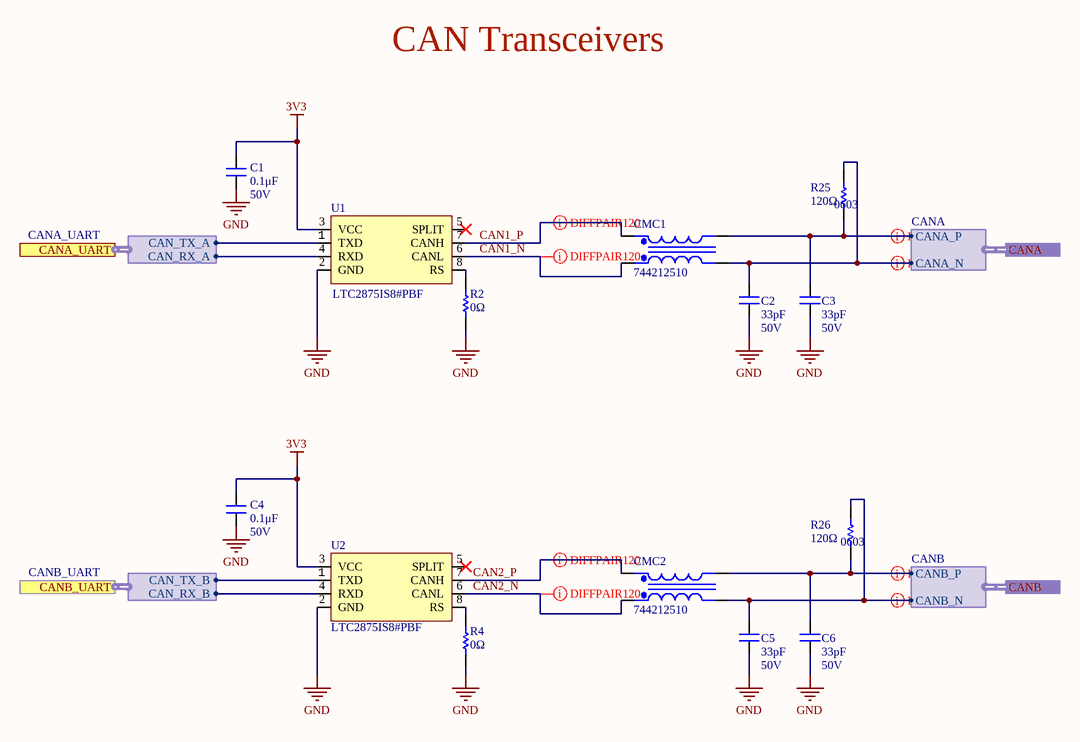
[diagram p4: SH5 - CAN.SchDoc]

### Parts
C1  value 0.1μF  Voltage Rating: 50V  [CAP0603]  (hidden comment: CAP_0.1uF_50V_0603)
C2  value 33pF  Voltage: 50V  [CAP0603]  (hidden comment: CAP_33pF_50V_0603)
C3  value 33pF  Voltage: 50V  [CAP0603]  (hidden comment: CAP_33pF_50V_0603)
C4  value 0.1μF  Voltage Rating: 50V  [CAP0603]  (hidden comment: CAP_0.1uF_50V_0603)
C5  value 33pF  Voltage: 50V  [CAP0603]  (hidden comment: CAP_33pF_50V_0603)
C6  value 33pF  Voltage: 50V  [CAP0603]  (hidden comment: CAP_33pF_50V_0603)
CMC1  CMC_51uH  [744212510]  (value not drawn)
CMC2  CMC_51uH  [744212510]  (value not drawn)
R2  value 0Ω  [RESC0603]  (hidden comment: RES_0Ω_0603)
R4  value 0Ω  [RESC0603]  (hidden comment: RES_0Ω_0603)
R25  value 120Ω  Package/Footprint: 0603  [RESC0603]  (hidden comment: RES_120Ω_0603)
R26  value 120Ω  Package/Footprint: 0603  [RESC0603]  (hidden comment: RES_120Ω_0603)
U1  Manufacturer Part Number 1: LTC2875IS8#PBF  [LT-S8_N]  (hidden comment: LTC2875)
U2  Manufacturer Part Number 1: LTC2875IS8#PBF  [LT-S8_N]  (hidden comment: LTC2875)

### Ports
CANA (harness CANA), CANA_UART (harness CANA_UART), CANB (harness CANB), CANB_UART (harness CANB_UART)

### Harnesses
CANA_UART: CAN_RX_A, CAN_TX_A
CANA: CANA_N, CANA_P
CANB: CANB_N, CANB_P
CANB_UART: CAN_RX_B, CAN_TX_B

### Nets
3V3: C1.1 C4.1 U1.3(VCC) U2.3(VCC)
GND: C1.2 C2.1 C3.1 C4.2 C5.1 C6.1 R2.1 R4.1 U1.2(GND) U2.2(GND)
CAN1_N: CMC1.1(Pri+) U1.6(CANL)
CAN1_P: CMC1.3(Sec+) U1.7(CANH)
CAN2_N: CMC2.1(Pri+) U2.6(CANL)
CAN2_P: CMC2.3(Sec+) U2.7(CANH)
CANA_N: C2.2 CMC1.5(Pri-) R25.2 ; port CANA.CANA_N
CANA_P: C3.2 CMC1.4(Sec-) R25.1 ; port CANA.CANA_P
CANB_N: C5.2 CMC2.5(Pri-) R26.2 ; port CANB.CANB_N
CANB_P: C6.2 CMC2.4(Sec-) R26.1 ; port CANB.CANB_P
NetR2_2: R2.2 U1.8(RS)
NetR4_2: R4.2 U2.8(RS)
NetU1_1: U1.1(TXD) ; port CANA_UART.CAN_TX_A
NetU1_4: U1.4(RXD) ; port CANA_UART.CAN_RX_A
NetU2_1: U2.1(TXD) ; port CANB_UART.CAN_TX_B
NetU2_4: U2.4(RXD) ; port CANB_UART.CAN_RX_B

Not connected (* = marked no-connect by the designer): U1 5(SPLIT)*; U2 5(SPLIT)*

### Layout directives
differential pair: CAN1_N, CAN1_P, CAN2_N, CAN2_P, CANA_N, CANA_P, CANB_N, CANB_P

### Notes on the sheet
- CAN Transceivers
- Title:
- Project:
- Date:
- Rev:
- Checker:
- Engineer:
- Sheet:
- of

### Library data of the parts
C1 C4 = CAP_0.1uF_50V_0603: as C26 on sheet SH2 - CONNECTORS; Temperature Coefficient: X7R; Supplier Part Number 1: 311-1344-1-ND; Supplier 1: Digi-Key; Dielectric: X7R; Mounting Type: SMD
C2 C3 C5 C6 = CAP_33pF_50V_0603: CAP CER 33PF 50V C0G/NP0; Manufacturer 1: Yageo; Manufacturer Part Number 1: CC0603JRNPO9BN330; Dielectric Material: Ceramic; Temperature Coefficient: 30ppm/°C; Tolerance: 5%; Dielectric: C0G; Insulation Resistance: 100GR; Package/Footprint: 0603; Supplier 1: Digi-Key; Mount: Surface Mount; Number of Pins: 2; Case Code (Metric): 1608; Min Operating Temperature: -55°C; Max Operating Temperature: 125°C; Composition: Ceramic; Voltage Rating: 50V; Voltage Rating (DC): 50V; Length: 1.6mm; Height: 0.8mm; Thickness: 0.035inch; Depth: 0.8mm; Width: 0.031inch; REACH SVHC: No SVHC; Supplier Part Number 1: 311-1064-1-ND; Mounting Type: SMD
CMC1 CMC2 = CMC_51uH: CMC 51uH 300MA 2LN SMD; Manufacturer 1: Wurth Electronics; Core Material: Ferrite; DC Resistance (DCR): 160mR; Test Frequency: 100kHz; Inductance Tolerance: 50%; Voltage Rating (DC): 80V; Number of Lines: 2; Impedance: 300R; Supplier 1: Digi-Key; Manufacturer Part Number 1: 744212510; Mount: Surface Mount; Number of Pins: 4; Min Operating Temperature: -40°C; Max Operating Temperature: 105°C; Current: 300mA; Max DC Current: 300mA; Current Rating: 300mA; Inductance: 51uH; Tolerance: 50%; Length: 6.5mm; Height: 1.65mm; Depth: 3.6mm; Width: 0.142inch; REACH SVHC: No SVHC; ComponentLink7URL: https://datasheet.ciiva.com/6216/744212510-6216348.pdf?src-supplier=Digi-Key; ComponentLink7Description: https://datasheet.ciiva.com/6216/744212510-6216348.pdf?src-supplier=Digi-Key; ComponentLink8URL: https://datasheet.ciiva.com/7764/1735560-7764951.pdf?src-supplier=Element14; ComponentLink8Description: https://datasheet.ciiva.com/7764/1735560-7764951.pdf?src-supplier=Element14; Supplier Part Number 1: 732-3941-1-ND; Package/Footprint: SMD; Mounting Type: SMD
R2 R4 = RES_0Ω_0603: RES 0 OHM JUMPER 1/10W 0603; Manufacturer 1: Yageo; Manufacturer Part Number 1: RC0603JR-070RL; Package/Footprint: 0603; Supplier Part Number 1: 311-0.0GRCT-ND; Supplier 1: Digi-Key; Mounting Type: SMD
R25 R26 = RES_120Ω_0603_5%: as R21 on sheet SH1 - POWER; Package: 0603 (1608 Metric); Supplier Part Number 1: 311-120GRCT-ND; Supplier 1: Digi-Key; Mounting Type: SMD
U1 U2 = LTC2875: IC TXRX CAN 4MBPS 8SO; Manufacturer 1: Linear Technologies; Package/Footprint: 8-SOIC; Supplier Part Number 1: LTC2875IS8#PBF-ND; Supplier 1: Digi-Key; Mounting Type: SMD; LCSC Part #: C117076

## Nets that join several sheets
3V3: SH1 - POWER (6 pins), SH2 - CONNECTORS (8 pins), SH3 - LEVEL SHIFTER (C24.2 R24.1 U5.2), SH4 - MICROCONTROLLER (18 pins), SH5 - CAN (C1.1 C4.1 U1.3 U2.3)
5V0: SH1 - POWER (7 pins), SH2 - CONNECTORS (7 pins), SH3 - LEVEL SHIFTER (C25.2 U5.19)
GND: SH1 - POWER (13 pins), SH2 - CONNECTORS (56 pins), SH3 - LEVEL SHIFTER (C24.1 C25.1 U5.11), SH4 - MICROCONTROLLER (30 pins), SH5 - CAN (10 pins)
CANA_N: SH2 - CONNECTORS (D1.1 J6.1 J6.5), SH5 - CAN (C2.2 CMC1.5 R25.2)
CANA_P: SH2 - CONNECTORS (D1.2 J6.2 J6.4), SH5 - CAN (C3.2 CMC1.4 R25.1)
CANB_N: SH2 - CONNECTORS (D2.1 J7.1 J7.5), SH5 - CAN (C5.2 CMC2.5 R26.2)
CANB_P: SH2 - CONNECTORS (D2.2 J7.2 J7.4), SH5 - CAN (C6.2 CMC2.4 R26.1)
DIR_CENTRIFUGE: SH2 - CONNECTORS (D8.2 J4.1), SH4 - MICROCONTROLLER (U3.24)
DIR_LIFT: SH2 - CONNECTORS (D11.2 J5.6), SH4 - MICROCONTROLLER (U3.25)
I2C_SCL: SH2 - CONNECTORS (D7.2 J3.5 R6.1), SH4 - MICROCONTROLLER (TP2.1 U3.41)
I2C_SDA: SH2 - CONNECTORS (D3.2 J3.4 R5.1), SH4 - MICROCONTROLLER (TP1.1 U3.40)
LIFT_ENC_CHANNEL_A_3V3: SH3 - LEVEL SHIFTER (U5.3), SH4 - MICROCONTROLLER (U3.58)
LIFT_ENC_CHANNEL_A_5V: SH2 - CONNECTORS (J5.3), SH3 - LEVEL SHIFTER (TP10.1 U5.18)
LIFT_ENC_CHANNEL_B_3V3: SH3 - LEVEL SHIFTER (U5.4), SH4 - MICROCONTROLLER (U3.59)
LIFT_ENC_CHANNEL_B_5V: SH2 - CONNECTORS (J5.2), SH3 - LEVEL SHIFTER (TP11.1 U5.17)
LIM_SW1: SH2 - CONNECTORS (D12.2 J8.1 R9.1), SH4 - MICROCONTROLLER (U3.4)
LIM_SW2: SH2 - CONNECTORS (D13.2 J8.3 R10.1), SH4 - MICROCONTROLLER (U3.3)
LIM_SW3: SH2 - CONNECTORS (D14.2 J8.5 R11.1), SH4 - MICROCONTROLLER (U3.2)
LIM_SW4: SH2 - CONNECTORS (D15.2 J8.7 R12.1), SH4 - MICROCONTROLLER (U3.62)
LIM_SW5: SH2 - CONNECTORS (D16.2 J8.9 R13.1), SH4 - MICROCONTROLLER (U3.61)
NetU1_1: SH4 - MICROCONTROLLER (U3.45), SH5 - CAN (U1.1)
NetU1_4: SH4 - MICROCONTROLLER (U3.44), SH5 - CAN (U1.4)
NetU2_1: SH4 - MICROCONTROLLER (U3.34), SH5 - CAN (U2.1)
NetU2_4: SH4 - MICROCONTROLLER (U3.33), SH5 - CAN (U2.4)
PWM_CENTRIFUGE: SH2 - CONNECTORS (D9.2 J4.2 R7.2), SH4 - MICROCONTROLLER (U3.23)
PWM_LID_3V3: SH3 - LEVEL SHIFTER (U5.5), SH4 - MICROCONTROLLER (U3.29)
PWM_LID_5V: SH2 - CONNECTORS (J2.1), SH3 - LEVEL SHIFTER (TP12.1 U5.16)
PWM_LIFT: SH2 - CONNECTORS (D10.2 J5.7 R8.2), SH4 - MICROCONTROLLER (U3.22)
PWM_SHOVEL_3V3: SH3 - LEVEL SHIFTER (U5.6), SH4 - MICROCONTROLLER (U3.28)
PWM_SHOVEL_5V: SH2 - CONNECTORS (J2.5), SH3 - LEVEL SHIFTER (TP13.1 U5.15)
SPI_CS_3V3: SH3 - LEVEL SHIFTER (U5.9), SH4 - MICROCONTROLLER (U3.20)
SPI_CS_5V: SH2 - CONNECTORS (J1.2), SH3 - LEVEL SHIFTER (TP16.1 U5.12)
SPI_MISO_3V3: SH3 - LEVEL SHIFTER (U5.7), SH4 - MICROCONTROLLER (U3.56)
SPI_MISO_5V: SH2 - CONNECTORS (J1.5), SH3 - LEVEL SHIFTER (TP14.1 U5.14)
SPI_SCK_3V3: SH3 - LEVEL SHIFTER (U5.8), SH4 - MICROCONTROLLER (U3.21)
SPI_SCK_5V: SH2 - CONNECTORS (J1.4), SH3 - LEVEL SHIFTER (TP15.1 U5.13)